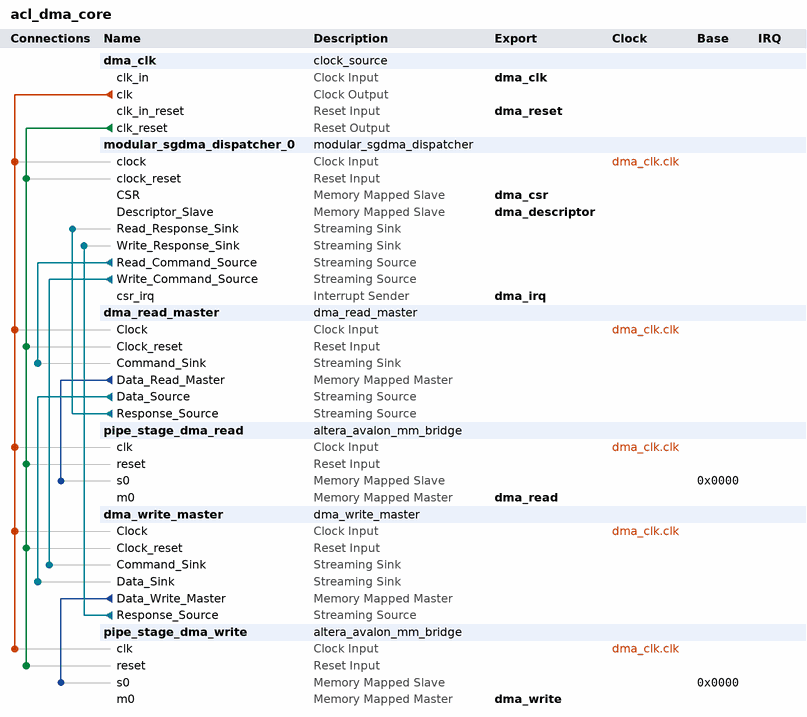
[diagram p0: system contents]
# Platform Designer (Qsys) system acl_dma_core, Stratix V Unknown
# Parameters at their usual value, and those the tool derives, are not listed.
package require -exact qsys 12.1
create_system acl_dma_core
set_project_property DEVICE_FAMILY {Stratix V}
set_project_property DEVICE Unknown

add_instance dma_clk clock_source 12.1
set_instance_parameter_value dma_clk clockFrequency 50000000
set_instance_parameter_value dma_clk clockFrequencyKnown false
set_instance_parameter_value dma_clk resetSynchronousEdges DEASSERT

add_instance modular_sgdma_dispatcher_0 modular_sgdma_dispatcher 1.0
set_instance_parameter_value modular_sgdma_dispatcher_0 MODE 0
set_instance_parameter_value modular_sgdma_dispatcher_0 GUI_RESPONSE_PORT 2
set_instance_parameter_value modular_sgdma_dispatcher_0 DESCRIPTOR_FIFO_DEPTH 128
set_instance_parameter_value modular_sgdma_dispatcher_0 ENHANCED_FEATURES 1
set_instance_parameter_value modular_sgdma_dispatcher_0 CSR_ADDRESS_WIDTH 3

add_instance dma_read_master dma_read_master 1.0
set_instance_parameter_value dma_read_master DATA_WIDTH 512
set_instance_parameter_value dma_read_master LENGTH_WIDTH 20
set_instance_parameter_value dma_read_master FIFO_DEPTH 128
set_instance_parameter_value dma_read_master STRIDE_ENABLE 0
set_instance_parameter_value dma_read_master GUI_STRIDE_WIDTH 1
set_instance_parameter_value dma_read_master BURST_ENABLE 1
set_instance_parameter_value dma_read_master GUI_MAX_BURST_COUNT 16
set_instance_parameter_value dma_read_master GUI_PROGRAMMABLE_BURST_ENABLE 0
set_instance_parameter_value dma_read_master GUI_BURST_WRAPPING_SUPPORT 1
set_instance_parameter_value dma_read_master TRANSFER_TYPE {Full Word Accesses Only}
set_instance_parameter_value dma_read_master PACKET_ENABLE 0
set_instance_parameter_value dma_read_master ERROR_ENABLE 0
set_instance_parameter_value dma_read_master ERROR_WIDTH 8
set_instance_parameter_value dma_read_master CHANNEL_ENABLE 0
set_instance_parameter_value dma_read_master CHANNEL_WIDTH 8
set_instance_parameter_value dma_read_master ADDRESS_WIDTH 48
set_instance_parameter_value dma_read_master FIFO_SPEED_OPTIMIZATION 1

add_instance pipe_stage_dma_read altera_avalon_mm_bridge 12.1
set_instance_parameter_value pipe_stage_dma_read DATA_WIDTH 512
set_instance_parameter_value pipe_stage_dma_read ADDRESS_WIDTH 48
set_instance_parameter_value pipe_stage_dma_read ADDRESS_UNITS SYMBOLS
set_instance_parameter_value pipe_stage_dma_read MAX_BURST_SIZE 16
set_instance_parameter_value pipe_stage_dma_read MAX_PENDING_RESPONSES 64

add_instance dma_write_master dma_write_master 1.0
set_instance_parameter_value dma_write_master DATA_WIDTH 512
set_instance_parameter_value dma_write_master LENGTH_WIDTH 20
set_instance_parameter_value dma_write_master FIFO_DEPTH 128
set_instance_parameter_value dma_write_master STRIDE_ENABLE 0
set_instance_parameter_value dma_write_master GUI_STRIDE_WIDTH 1
set_instance_parameter_value dma_write_master BURST_ENABLE 1
set_instance_parameter_value dma_write_master GUI_MAX_BURST_COUNT 16
set_instance_parameter_value dma_write_master GUI_PROGRAMMABLE_BURST_ENABLE 0
set_instance_parameter_value dma_write_master GUI_BURST_WRAPPING_SUPPORT 1
set_instance_parameter_value dma_write_master TRANSFER_TYPE {Full Word Accesses Only}
set_instance_parameter_value dma_write_master PACKET_ENABLE 0
set_instance_parameter_value dma_write_master ERROR_ENABLE 0
set_instance_parameter_value dma_write_master ERROR_WIDTH 8
set_instance_parameter_value dma_write_master ADDRESS_WIDTH 48
set_instance_parameter_value dma_write_master FIFO_SPEED_OPTIMIZATION 1

add_instance pipe_stage_dma_write altera_avalon_mm_bridge 12.1
set_instance_parameter_value pipe_stage_dma_write DATA_WIDTH 512
set_instance_parameter_value pipe_stage_dma_write ADDRESS_WIDTH 48
set_instance_parameter_value pipe_stage_dma_write ADDRESS_UNITS SYMBOLS
set_instance_parameter_value pipe_stage_dma_write MAX_BURST_SIZE 16
set_instance_parameter_value pipe_stage_dma_write MAX_PENDING_RESPONSES 64

# connections
add_connection dma_clk.clk dma_read_master.Clock clock
add_connection dma_clk.clk dma_write_master.Clock clock
add_connection dma_clk.clk modular_sgdma_dispatcher_0.clock clock
add_connection dma_clk.clk pipe_stage_dma_read.clk clock
add_connection dma_clk.clk pipe_stage_dma_write.clk clock
add_connection dma_clk.clk_reset dma_read_master.Clock_reset reset
add_connection dma_clk.clk_reset dma_write_master.Clock_reset reset
add_connection dma_clk.clk_reset modular_sgdma_dispatcher_0.clock_reset reset
add_connection dma_clk.clk_reset pipe_stage_dma_read.reset reset
add_connection dma_clk.clk_reset pipe_stage_dma_write.reset reset
add_connection dma_read_master.Data_Read_Master pipe_stage_dma_read.s0 avalon
set_connection_parameter_value dma_read_master.Data_Read_Master/pipe_stage_dma_read.s0 baseAddress 0x0000
add_connection dma_write_master.Data_Write_Master pipe_stage_dma_write.s0 avalon
set_connection_parameter_value dma_write_master.Data_Write_Master/pipe_stage_dma_write.s0 baseAddress 0x0000
add_connection dma_read_master.Data_Source dma_write_master.Data_Sink avalon_streaming
add_connection dma_read_master.Response_Source modular_sgdma_dispatcher_0.Read_Response_Sink avalon_streaming
add_connection dma_write_master.Response_Source modular_sgdma_dispatcher_0.Write_Response_Sink avalon_streaming
add_connection modular_sgdma_dispatcher_0.Read_Command_Source dma_read_master.Command_Sink avalon_streaming
add_connection modular_sgdma_dispatcher_0.Write_Command_Source dma_write_master.Command_Sink avalon_streaming

# exported interfaces
add_interface dma_irq interrupt sender
set_interface_property dma_irq EXPORT_OF modular_sgdma_dispatcher_0.csr_irq
add_interface dma_clk clock sink
set_interface_property dma_clk EXPORT_OF dma_clk.clk_in
add_interface dma_reset reset sink
set_interface_property dma_reset EXPORT_OF dma_clk.clk_in_reset
add_interface dma_csr avalon slave
set_interface_property dma_csr EXPORT_OF modular_sgdma_dispatcher_0.CSR
add_interface dma_descriptor avalon slave
set_interface_property dma_descriptor EXPORT_OF modular_sgdma_dispatcher_0.Descriptor_Slave
add_interface dma_read avalon master
set_interface_property dma_read EXPORT_OF pipe_stage_dma_read.m0
add_interface dma_write avalon master
set_interface_property dma_write EXPORT_OF pipe_stage_dma_write.m0

save_system acl_dma_core.qsys
